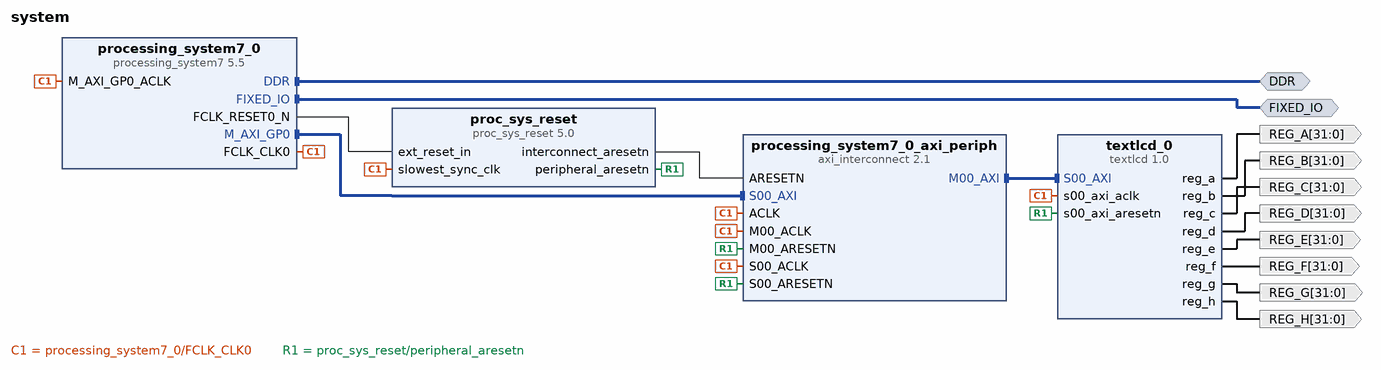
[diagram p0: block diagram of the top level]
# Vivado block design system, Vivado 2014.4_63036
create_bd_design system

create_bd_intf_port -mode Master -vlnv xilinx.com:interface:ddrx_rtl:1.0 DDR
create_bd_intf_port -mode Master -vlnv xilinx.com:display_processing_system7:fixedio_rtl:1.0 FIXED_IO
create_bd_port -dir O -from 31 -to 0 -type data REG_A
create_bd_port -dir O -from 31 -to 0 -type data REG_B
create_bd_port -dir O -from 31 -to 0 -type data REG_C
create_bd_port -dir O -from 31 -to 0 -type data REG_D
create_bd_port -dir O -from 31 -to 0 -type data REG_E
create_bd_port -dir O -from 31 -to 0 -type data REG_F
create_bd_port -dir O -from 31 -to 0 -type data REG_G
create_bd_port -dir O -from 31 -to 0 -type data REG_H

create_bd_cell -type ip -vlnv xilinx.com:user:textlcd:1.0 textlcd_0
create_bd_cell -type ip -vlnv xilinx.com:ip:proc_sys_reset:5.0 proc_sys_reset
create_bd_cell -type ip -vlnv xilinx.com:ip:processing_system7:5.5 processing_system7_0
set_property -dict [list \
  CONFIG.PCW_PRESET_BANK1_VOLTAGE {LVCMOS 1.8V} \
  CONFIG.PCW_UIPARAM_DDR_PARTNO {MT41J256M16 RE-125} \
  CONFIG.PCW_UART1_PERIPHERAL_ENABLE 1 \
] [get_bd_cells processing_system7_0]
# 13 more settings of processing_system7_0 are not shown: defaults, MIO pin electricals, DDR timing, and values the tool derives
create_bd_cell -type ip -vlnv xilinx.com:ip:axi_interconnect:2.1 processing_system7_0_axi_periph
set_property -dict {CONFIG.NUM_MI 1} [get_bd_cells processing_system7_0_axi_periph]

# ---- connections ----

connect_bd_intf_net [get_bd_intf_pins processing_system7_0/M_AXI_GP0] [get_bd_intf_pins processing_system7_0_axi_periph/S00_AXI]
connect_bd_intf_net [get_bd_intf_pins processing_system7_0_axi_periph/M00_AXI] [get_bd_intf_pins textlcd_0/S00_AXI]
connect_bd_intf_net [get_bd_intf_ports DDR] [get_bd_intf_pins processing_system7_0/DDR]
connect_bd_intf_net [get_bd_intf_ports FIXED_IO] [get_bd_intf_pins processing_system7_0/FIXED_IO]
connect_bd_net [get_bd_pins processing_system7_0/FCLK_CLK0] \
  [get_bd_pins textlcd_0/s00_axi_aclk] [get_bd_pins proc_sys_reset/slowest_sync_clk] \
  [get_bd_pins processing_system7_0/M_AXI_GP0_ACLK] [get_bd_pins processing_system7_0_axi_periph/ACLK] \
  [get_bd_pins processing_system7_0_axi_periph/S00_ACLK] [get_bd_pins processing_system7_0_axi_periph/M00_ACLK]
connect_bd_net [get_bd_pins processing_system7_0/FCLK_RESET0_N] [get_bd_pins proc_sys_reset/ext_reset_in]
connect_bd_net [get_bd_pins proc_sys_reset/peripheral_aresetn] \
  [get_bd_pins textlcd_0/s00_axi_aresetn] [get_bd_pins processing_system7_0_axi_periph/S00_ARESETN] \
  [get_bd_pins processing_system7_0_axi_periph/M00_ARESETN]
connect_bd_net [get_bd_pins proc_sys_reset/interconnect_aresetn] [get_bd_pins processing_system7_0_axi_periph/ARESETN]
connect_bd_net [get_bd_pins textlcd_0/reg_a] [get_bd_ports REG_A]
connect_bd_net [get_bd_pins textlcd_0/reg_b] [get_bd_ports REG_B]
connect_bd_net [get_bd_pins textlcd_0/reg_c] [get_bd_ports REG_C]
connect_bd_net [get_bd_pins textlcd_0/reg_d] [get_bd_ports REG_D]
connect_bd_net [get_bd_pins textlcd_0/reg_e] [get_bd_ports REG_E]
connect_bd_net [get_bd_pins textlcd_0/reg_f] [get_bd_ports REG_F]
connect_bd_net [get_bd_pins textlcd_0/reg_g] [get_bd_ports REG_G]
connect_bd_net [get_bd_pins textlcd_0/reg_h] [get_bd_ports REG_H]

# ---- address map ----
assign_bd_address -offset 0x43C00000 -range 4K -target_address_space [get_bd_addr_spaces processing_system7_0/Data] [get_bd_addr_segs textlcd_0/S00_AXI/S00_AXI_reg]

validate_bd_design
save_bd_design
